# Altium project PR003.PrjPcb (part 4 of 11)

## Sheet HDMI_Connector.SchDoc
size A3; SheetNumber: 9; SheetTotal: 16
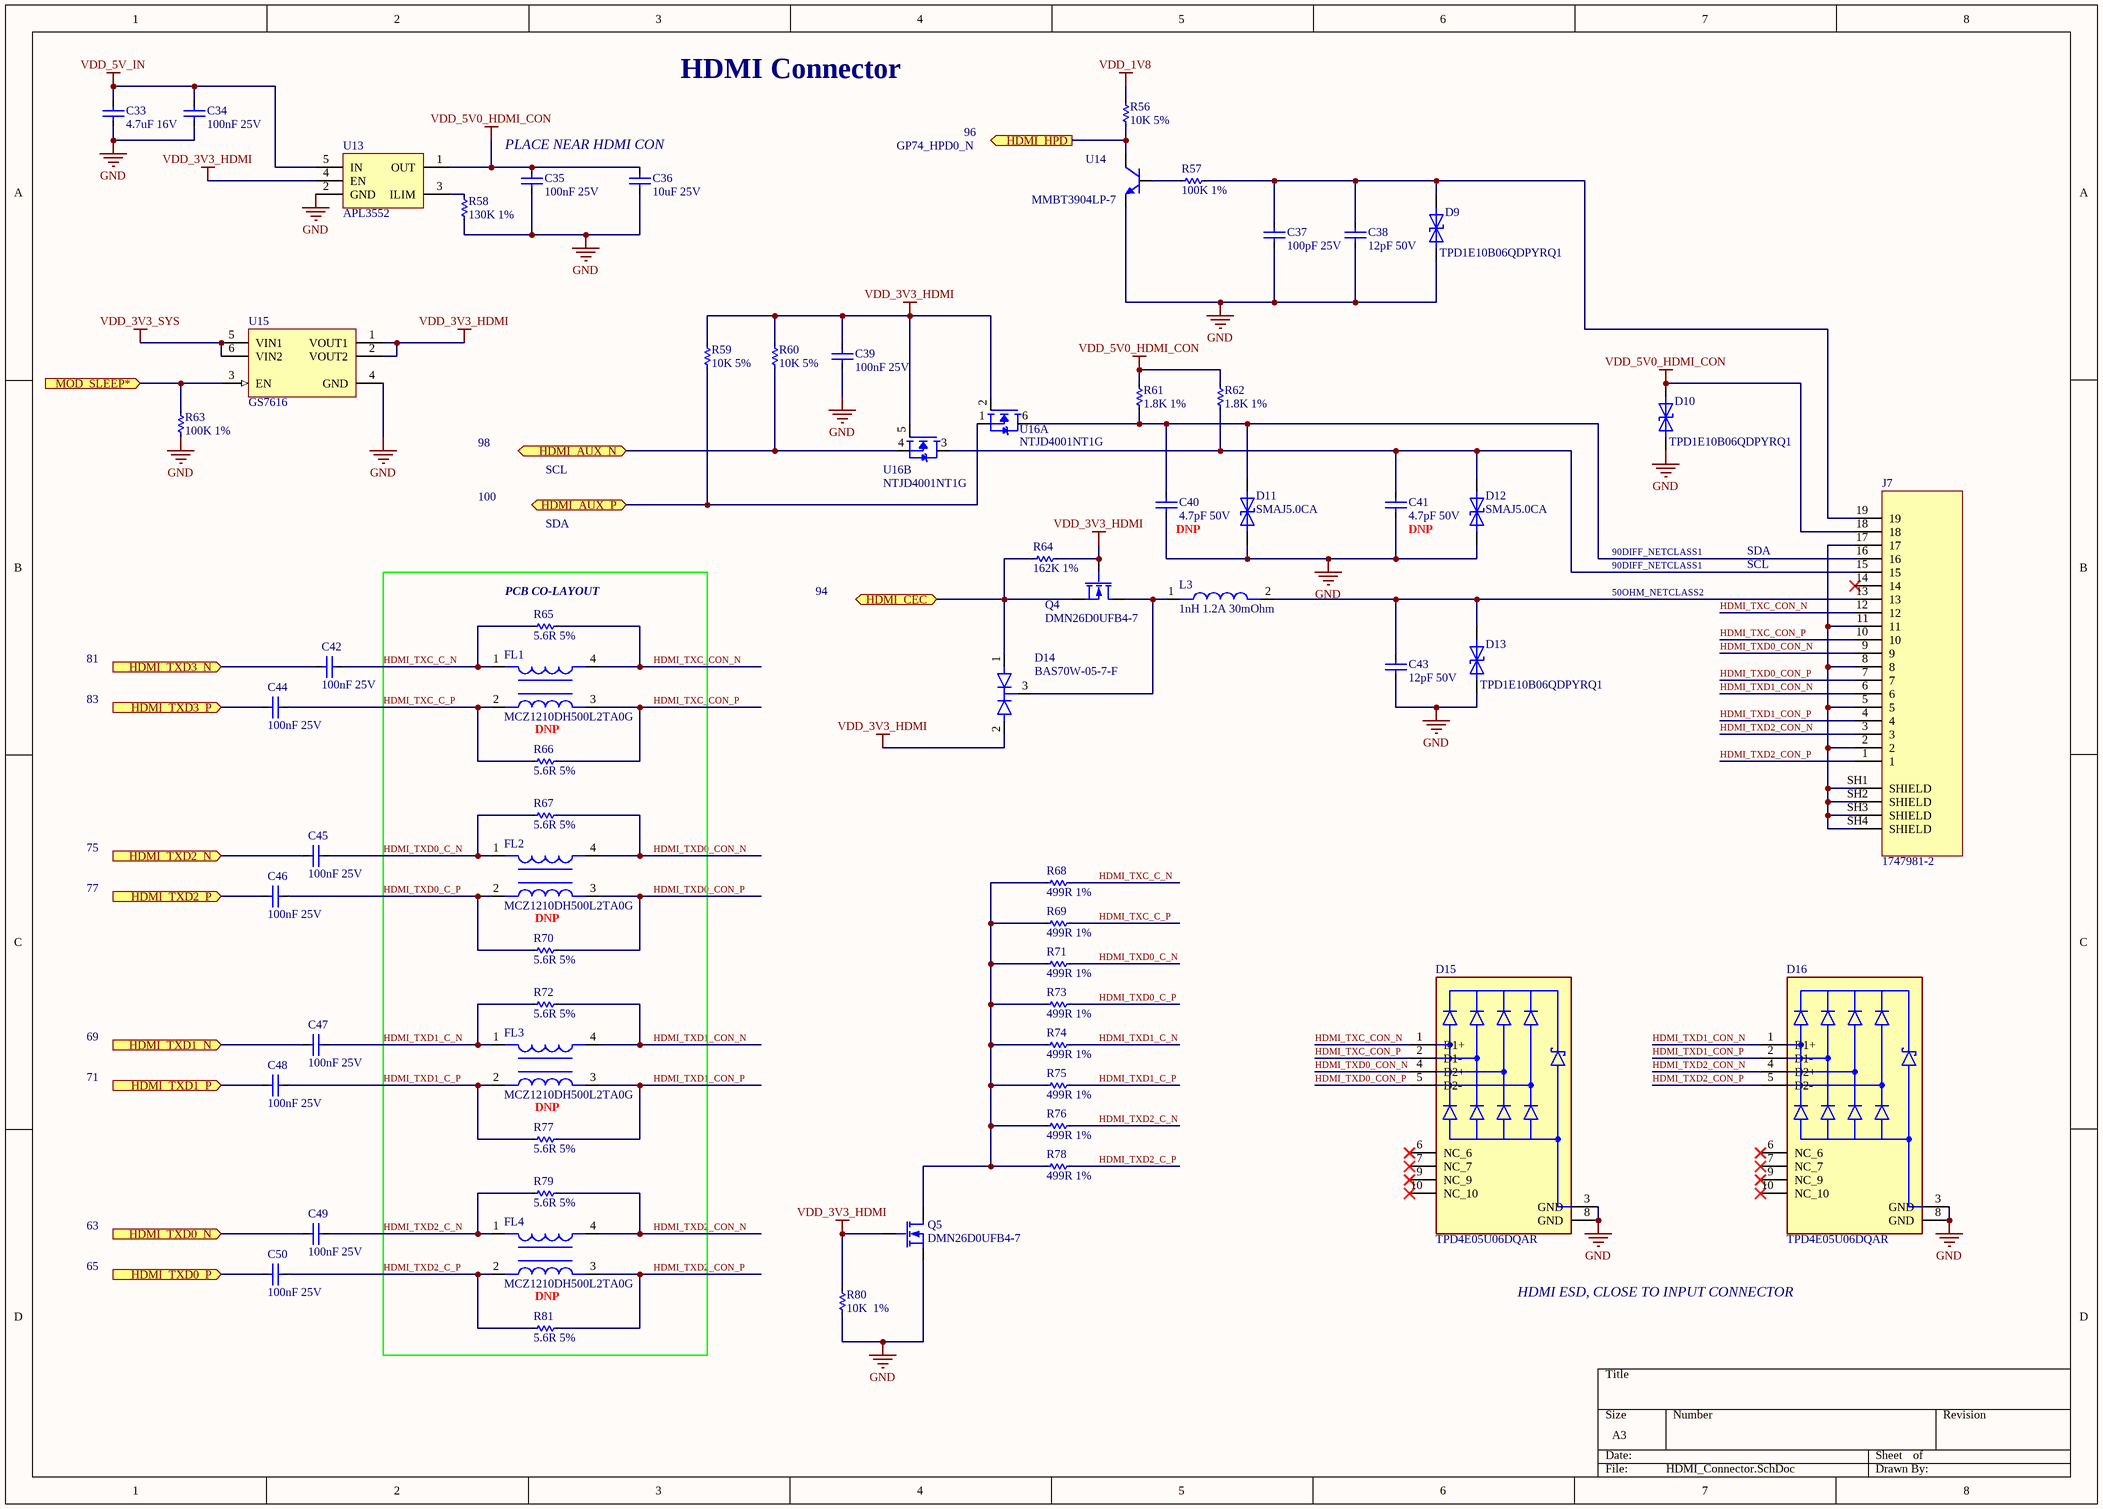
[diagram p7: HDMI_Connector.SchDoc]

### Parts
C33  4.7uF 16V  [C0805]
C34  100nF 25V  [C0402]
C35  100nF 25V  [C0402]
C36  10uF 25V  [C0805]
C37  100pF 25V  [C0402]
C38  12pF 50V  [C0402]
C39  100nF 25V  [C0402]
C40  4.7pF 50V  [C0402]
C41  4.7pF 50V  [C0402]
C42  100nF 25V  [C0402]
C43  12pF 50V  [C0402]
C44  100nF 25V  [C0402]
C45  100nF 25V  [C0402]
C46  100nF 25V  [C0402]
C47  100nF 25V  [C0402]
C48  100nF 25V  [C0402]
C49  100nF 25V  [C0402]
C50  100nF 25V  [C0402]
D9  TPD1E10B06QDPYRQ1  [2-X1SON (1x.60)]
D10  TPD1E10B06QDPYRQ1  [2-X1SON (1x.60)]
D11  SMAJ5.0CA  [DO-214AC]
D12  SMAJ5.0CA  [DO-214AC]
D13  TPD1E10B06QDPYRQ1  [2-X1SON (1x.60)]
D14  BAS70W-05-7-F  [SOT-323]
D15  TPD4E05U06DQAR  [TPD4E05U06DQAR]
D16  TPD4E05U06DQAR  [TPD4E05U06DQAR]
FL1  MCZ1210DH500L2TA0G  [MCZ1210DH500L2TA0G]
FL2  MCZ1210DH500L2TA0G  [MCZ1210DH500L2TA0G]
FL3  MCZ1210DH500L2TA0G  [MCZ1210DH500L2TA0G]
FL4  MCZ1210DH500L2TA0G  [MCZ1210DH500L2TA0G]
J7  1747981-2  [1747981-2]
L3  1nH 1.2A 30mOhm  [L0402]
Q4  DMN26D0UFB4-7  [DFN1006-3]
Q5  DMN26D0UFB4-7  [DFN1006-3]
R56  10K 5%  [R0402]
R57  100K 1%  [R0402]
R58  130K 1%  [R0402]
R59  10K 5%  [R0402]
R60  10K 5%  [R0402]
R61  1.8K 1%  [R0402]
R62  1.8K 1%  [R0402]
R63  100K 1%  [R0402]
R64  162K 1%  [R0402]
R65  5.6R 5%  [R0402]
R66  5.6R 5%  [R0402]
R67  5.6R 5%  [R0402]
R68  499R 1%  [R0402]
R69  499R 1%  [R0402]
R70  5.6R 5%  [R0402]
R71  499R 1%  [R0402]
R72  5.6R 5%  [R0402]
R73  499R 1%  [R0402]
R74  499R 1%  [R0402]
R75  499R 1%  [R0402]
R76  499R 1%  [R0402]
R77  5.6R 5%  [R0402]
R78  499R 1%  [R0402]
R79  5.6R 5%  [R0402]
R80  10K  1%  [R0402]
R81  5.6R 5%  [R0402]
U13  APL3552  [SOT23-5]
U14  MMBT3904LP-7  [DFN1006-3]
U15  GS7616  [SOT-363]
U16  NTJD4001NT1G  [SOT-363]  (parts A,B of 2)

### Ports
HDMI_AUX_N (bidir), HDMI_AUX_P (bidir), HDMI_CEC (bidir), HDMI_HPD (out), HDMI_TXD0_N (in), HDMI_TXD0_P (in), HDMI_TXD1_N (in), HDMI_TXD1_P (in), HDMI_TXD2_N (in), HDMI_TXD2_P (in), HDMI_TXD3_N (in), HDMI_TXD3_P (in), MOD_SLEEP* (in)

### Nets
GND: C33.1 C34.1 C35.1 C36.1 C37.1 C38.1 C39.1 C40.1 C41.1 C43.1 D9.1 D10.1 D11.C D12.C D13.1 D15.3(GND) D15.8(GND) D16.3(GND) D16.8(GND) Q5.2(S) R58.1 R63.1 R80.1 U13.2(GND) U14.2(E) U15.4(GND)
VDD_1V8: R56.2
VDD_3V3_HDMI: C39.2 D14.2 Q4.1(G) Q5.1(G) R59.2 R60.2 R64.2 R80.2 U13.4(EN) U15.1(VOUT1) U15.2(VOUT2) U16.2(G1) U16.5(G2)
VDD_3V3_SYS: U15.5(VIN1) U15.6(VIN2)
VDD_5V0_HDMI_CON: C35.2 C36.2 D10.2 J7.18 R61.2 R62.2 U13.1(OUT)
VDD_5V_IN: C33.2 C34.2 U13.5(IN)
HDMI_TXC_C_N: C42.2 FL1.1 R65.1 R68.2
HDMI_TXC_C_P: C44.2 FL1.2 R66.1 R69.2
HDMI_TXC_CON_N: D15.1(D1+) FL1.4 J7.12 R65.2
HDMI_TXC_CON_P: D15.2(D1-) FL1.3 J7.10 R66.2
HDMI_TXD0_C_N: C45.2 FL2.1 R67.1 R71.2
HDMI_TXD0_C_P: C46.2 FL2.2 R70.1 R73.2
HDMI_TXD0_CON_N: D15.4(D2+) FL2.4 J7.9 R67.2
HDMI_TXD0_CON_P: D15.5(D2-) FL2.3 J7.7 R70.2
HDMI_TXD1_C_N: C47.2 FL3.1 R72.1 R74.2
HDMI_TXD1_C_P: C48.2 FL3.2 R75.2 R77.1
HDMI_TXD1_CON_N: D16.1(D1+) FL3.4 J7.6 R72.2
HDMI_TXD1_CON_P: D16.2(D1-) FL3.3 J7.4 R77.2
HDMI_TXD2_C_N: C49.2 FL4.1 R76.2 R79.1
HDMI_TXD2_C_P: C50.2 FL4.2 R78.2 R81.1
HDMI_TXD2_CON_N: D16.4(D2+) FL4.4 J7.3 R79.2
HDMI_TXD2_CON_P: D16.5(D2-) FL4.3 J7.1 R81.2
MOD_SLEEP*: R63.2 U15.3(EN) ; port MOD_SLEEP*
NetC37_2: C37.2 C38.2 D9.2 J7.19 R57.2
NetC40_2: C40.2 D11.A J7.16 R61.1 U16.6(D1)
NetC41_2: C41.2 D12.A J7.15 R62.1 U16.3(D2)
NetC42_1: C42.1 ; port HDMI_TXD3_N
NetC43_2: C43.2 D13.2 J7.13 L3.2
NetC44_1: C44.1 ; port HDMI_TXD3_P
NetC45_1: C45.1 ; port HDMI_TXD2_N
NetC46_1: C46.1 ; port HDMI_TXD2_P
NetC47_1: C47.1 ; port HDMI_TXD1_N
NetC48_1: C48.1 ; port HDMI_TXD1_P
NetC49_1: C49.1 ; port HDMI_TXD0_N
NetC50_1: C50.1 ; port HDMI_TXD0_P
NetD14_1: D14.1 Q4.2(S) R64.1 ; port HDMI_CEC
NetD14_3: D14.3 L3.1 Q4.3(D)
NetJ7_2: J7.2 J7.5 J7.8 J7.11 J7.17 J7.SH1(SHIELD) J7.SH2(SHIELD) J7.SH3(SHIELD) J7.SH4(SHIELD)
NetJ10_96: R56.1 U14.3(C) ; port HDMI_HPD
NetJ10_98: R60.1 U16.4(S2) ; port HDMI_AUX_N
NetJ10_100: R59.1 U16.1(S1) ; port HDMI_AUX_P
NetQ5_3: Q5.3(D) R68.1 R69.1 R71.1 R73.1 R74.1 R75.1 R76.1 R78.1
NetR57_1: R57.1 U14.1(B)
NetR58_2: R58.2 U13.3(ILIM)

Not connected (* = marked no-connect by the designer): D15 6(NC_6)* 7(NC_7)* 9(NC_9)* 10(NC_10)*; D16 6(NC_6)* 7(NC_7)* 9(NC_9)* 10(NC_10)*; J7 14*

### Notes on the sheet
- HDMI Connector
- PLACE NEAR HDMI CON
- GP74_HPD0_N
- 96
- 98
- 100
- SCL
- SDA
- (near C40) DNP
- (near C41) DNP
- 90DIFF_NETCLASS1
- (near R65) PCB CO-LAYOUT
- 94
- 50OHM_NETCLASS2
- 81
- 83
- DNP
- 75
- 77
- 69
- 71
- 63
- 65
- HDMI ESD, CLOSE TO INPUT CONNECTOR